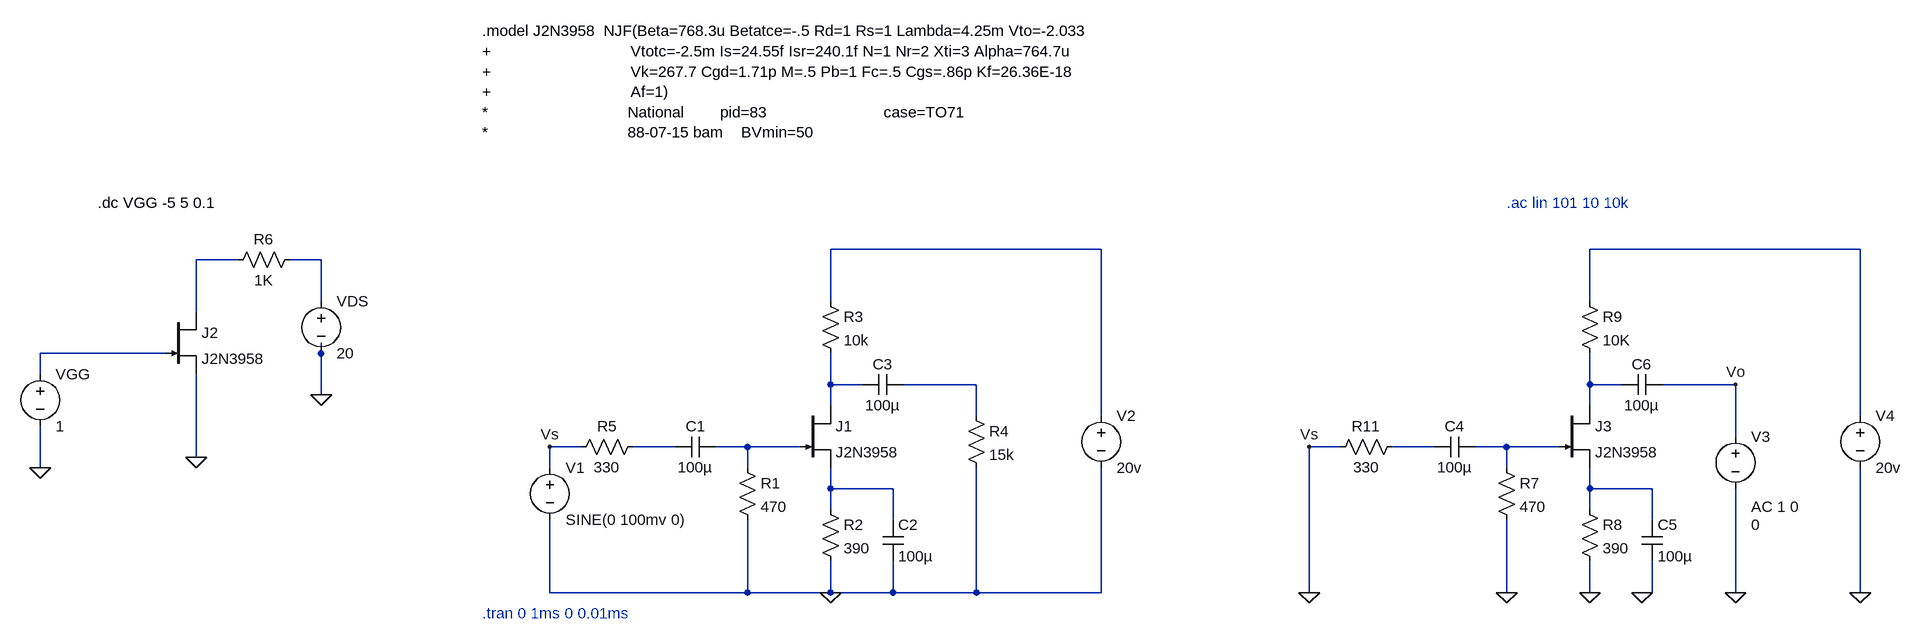
[diagram p0: schematic JFET.asc]
JFET.asc, the LTspice schematic file:
Version 4
SHEET 1 1880 820
WIRE 640 240 224 240
WIRE 1808 240 1392 240
WIRE -688 256 -752 256
WIRE -560 256 -608 256
WIRE -560 320 -560 256
WIRE 224 320 224 240
WIRE 1392 320 1392 240
WIRE -752 336 -752 256
WIRE -800 400 -992 400
WIRE -560 400 -560 384
WIRE -992 432 -992 400
WIRE 224 448 224 400
WIRE 272 448 224 448
WIRE 448 448 336 448
WIRE 1392 448 1392 400
WIRE 1440 448 1392 448
WIRE 1616 448 1504 448
WIRE -560 464 -560 400
WIRE 224 480 224 448
WIRE 1392 480 1392 448
WIRE 448 496 448 448
WIRE 640 496 640 240
WIRE 1808 496 1808 240
WIRE 1616 528 1616 448
WIRE -160 544 -208 544
WIRE -16 544 -80 544
WIRE 96 544 48 544
WIRE 176 544 96 544
WIRE 1008 544 960 544
WIRE 1152 544 1088 544
WIRE 1264 544 1216 544
WIRE 1344 544 1264 544
WIRE -752 560 -752 432
WIRE -992 576 -992 512
WIRE -208 576 -208 544
WIRE 96 576 96 544
WIRE 1264 576 1264 544
WIRE 224 608 224 576
WIRE 320 608 224 608
WIRE 1392 608 1392 576
WIRE 1488 608 1392 608
WIRE 224 640 224 608
WIRE 1392 640 1392 608
WIRE 320 656 320 608
WIRE 1488 656 1488 608
WIRE -208 768 -208 656
WIRE 96 768 96 656
WIRE 96 768 -208 768
WIRE 224 768 224 720
WIRE 224 768 96 768
WIRE 320 768 320 720
WIRE 320 768 224 768
WIRE 448 768 448 576
WIRE 448 768 320 768
WIRE 640 768 640 576
WIRE 640 768 448 768
WIRE 960 768 960 544
WIRE 1264 768 1264 656
WIRE 1392 768 1392 720
WIRE 1488 768 1488 720
WIRE 1616 768 1616 608
WIRE 1808 768 1808 576
FLAG 224 768 0
FLAG -992 576 0
FLAG -560 464 0
FLAG -752 560 0
FLAG -208 544 Vs
FLAG 1392 768 0
FLAG 1616 448 Vo
FLAG 960 544 Vs
FLAG 960 768 0
FLAG 1264 768 0
FLAG 1472 768 0
FLAG 1616 768 0
FLAG 1808 768 0
SYMBOL njf 176 480 R0
SYMATTR InstName J1
SYMATTR Value J2N3958
SYMBOL res 80 560 R0
SYMATTR InstName R1
SYMATTR Value 470
SYMBOL cap 48 528 R90
WINDOW 0 0 32 VBottom 2
WINDOW 3 32 32 VTop 2
SYMATTR InstName C1
SYMATTR Value 100µ
SYMBOL voltage -208 560 R0
WINDOW 123 0 0 Left 0
WINDOW 39 0 0 Left 0
SYMATTR InstName V1
SYMATTR Value SINE(0 100mv 0)
SYMBOL res 208 624 R0
SYMATTR InstName R2
SYMATTR Value 390
SYMBOL cap 304 656 R0
SYMATTR InstName C2
SYMATTR Value 100µ
SYMBOL res 208 304 R0
SYMATTR InstName R3
SYMATTR Value 10k
SYMBOL cap 336 432 R90
WINDOW 0 0 32 VBottom 2
WINDOW 3 32 32 VTop 2
SYMATTR InstName C3
SYMATTR Value 100µ
SYMBOL res 432 480 R0
SYMATTR InstName R4
SYMATTR Value 15k
SYMBOL voltage 640 480 R0
SYMATTR InstName V2
SYMATTR Value 20v
SYMBOL res -64 528 R90
WINDOW 0 0 56 VBottom 2
WINDOW 3 32 56 VTop 2
SYMATTR InstName R5
SYMATTR Value 330
SYMBOL njf -800 336 R0
SYMATTR InstName J2
SYMATTR Value J2N3958
SYMBOL voltage -992 416 R0
WINDOW 123 0 0 Left 0
WINDOW 39 0 0 Left 0
SYMATTR InstName VGG
SYMATTR Value 1
SYMBOL voltage -560 304 R0
WINDOW 123 0 0 Left 0
WINDOW 39 0 0 Left 0
SYMATTR InstName VDS
SYMATTR Value 20
SYMBOL res -592 240 R90
WINDOW 0 0 56 VBottom 2
WINDOW 3 32 56 VTop 2
SYMATTR InstName R6
SYMATTR Value 1K
SYMBOL njf 1344 480 R0
SYMATTR InstName J3
SYMATTR Value J2N3958
SYMBOL res 1248 560 R0
SYMATTR InstName R7
SYMATTR Value 470
SYMBOL cap 1216 528 R90
WINDOW 0 0 32 VBottom 2
WINDOW 3 32 32 VTop 2
SYMATTR InstName C4
SYMATTR Value 100µ
SYMBOL res 1376 624 R0
SYMATTR InstName R8
SYMATTR Value 390
SYMBOL cap 1472 656 R0
SYMATTR InstName C5
SYMATTR Value 100µ
SYMBOL res 1376 304 R0
SYMATTR InstName R9
SYMATTR Value 10K
SYMBOL cap 1504 432 R90
WINDOW 0 0 32 VBottom 2
WINDOW 3 32 32 VTop 2
SYMATTR InstName C6
SYMATTR Value 100µ
SYMBOL voltage 1808 480 R0
SYMATTR InstName V4
SYMATTR Value 20v
SYMBOL res 1104 528 R90
WINDOW 0 0 56 VBottom 2
WINDOW 3 32 56 VTop 2
SYMATTR InstName R11
SYMATTR Value 330
SYMBOL voltage 1616 512 R0
WINDOW 3 24 152 Left 2
WINDOW 123 24 124 Left 2
WINDOW 39 0 0 Left 0
SYMATTR InstName V3
SYMATTR Value 0
SYMATTR Value2 AC 1 0
TEXT -312 -96 Left 2 !.model J2N3958  NJF(Beta=768.3u Betatce=-.5 Rd=1 Rs=1 Lambda=4.25m Vto=-2.033\n+                               Vtotc=-2.5m Is=24.55f Isr=240.1f N=1 Nr=2 Xti=3 Alpha=764.7u\n+                               Vk=267.7 Cgd=1.71p M=.5 Pb=1 Fc=.5 Cgs=.86p Kf=26.36E-18\n+                               Af=1)\n*                               National        pid=83                          case=TO71\n*                               88-07-15 bam    BVmin=50
TEXT -312 800 Left 2 ;.tran 0 1ms 0 0.01ms
TEXT -904 168 Left 2 !.dc VGG -5 5 0.1
TEXT 1264 168 Left 2 ;.ac lin 101 10 10k

The netlist it stands for:
* JFET.asc
J1 N006 N010 N013 J2N3958
R1 N010 0 470
C1 N010 N009 100µ
V1 0 0 SINE(0 100mv 0)
R2 N013 0 390
C2 N013 0 100µ
R3 N001 N006 10k
C3 N007 N006 100µ
R4 N007 0 15k
V2 N001 0 20v
R5 N009 0 330
J2 N003 N005 0 J2N3958
VGG N005 0 1
VDS N004 0 20
R6 N004 N003 1K
J3 N008 N012 N014 J2N3958
R7 N012 0 470
C4 N012 N011 100µ
R8 N014 0 390
C5 N014 N015 100µ
R9 N002 N008 10K
C6 Vo N008 100µ
V4 N002 0 20v
R11 N011 0 330
V3 Vo 0 0 AC 1 0
.model NJF NJF
.model PJF PJF
.lib standard.jft
.model J2N3958  NJF(Beta=768.3u Betatce=-.5 Rd=1 Rs=1 Lambda=4.25m Vto=-2.033
+                               Vtotc=-2.5m Is=24.55f Isr=240.1f N=1 Nr=2 Xti=3 Alpha=764.7u
+                               Vk=267.7 Cgd=1.71p M=.5 Pb=1 Fc=.5 Cgs=.86p Kf=26.36E-18
+                               Af=1)
*                               National        pid=83                          case=TO71
*                               88-07-15 bam    BVmin=50
* .tran 0 1ms 0 0.01ms
.dc VGG -5 5 0.1
* .ac lin 101 10 10k
.backanno
.end